# EAGLE schematic 7Seg 1Inch (EAGLE 7.2.0)
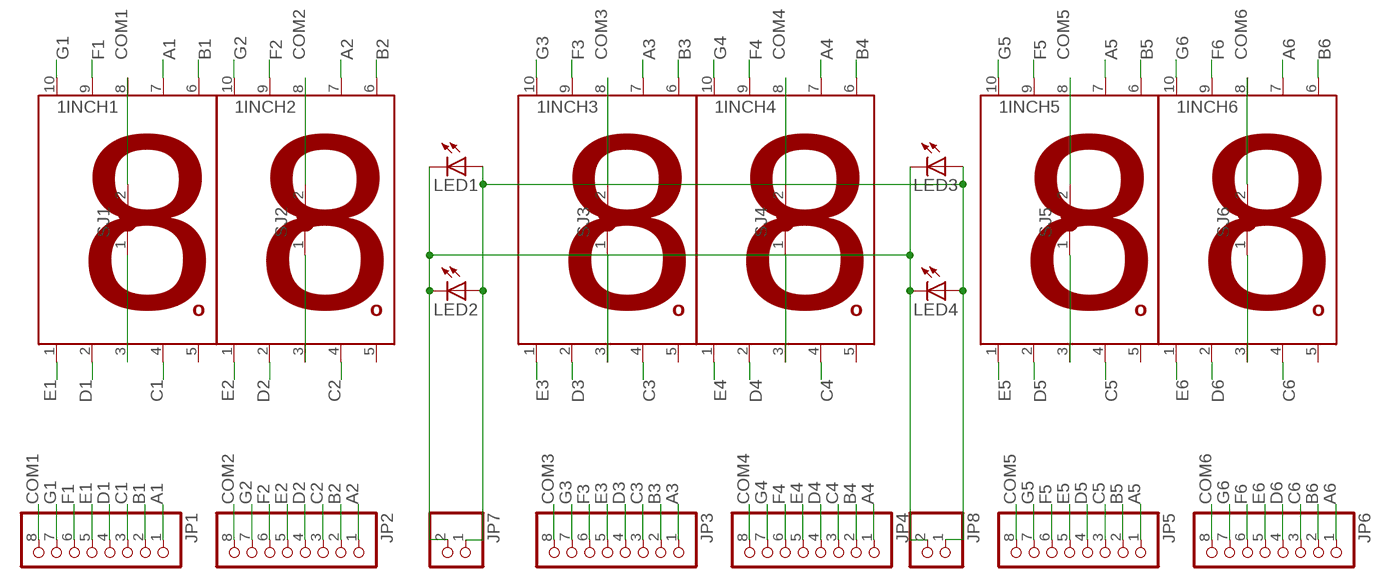
[diagram p0: schematic, sheet 1]

## Parts
1INCH1  7-SEG_1"_CUS  [7-SEG_1"_CUS]
1INCH2  7-SEG_1"_CUS  [7-SEG_1"_CUS]
1INCH3  7-SEG_1"_CUS  [7-SEG_1"_CUS]
1INCH4  7-SEG_1"_CUS  [7-SEG_1"_CUS]
1INCH5  7-SEG_1"_CUS  [7-SEG_1"_CUS]
1INCH6  7-SEG_1"_CUS  [7-SEG_1"_CUS]
JP1  PINHD-1X8  [1X08]
JP2  PINHD-1X8  [1X08]
JP3  PINHD-1X8  [1X08]
JP4  PINHD-1X8  [1X08]
JP5  PINHD-1X8  [1X08]
JP6  PINHD-1X8  [1X08]
JP7  PINHD-1X2  [1X02]
JP8  PINHD-1X2  [1X02]
LED1  LED5MM  [LED5MM]
LED2  LED5MM  [LED5MM]
LED3  LED5MM  [LED5MM]
LED4  LED5MM  [LED5MM]
SJ1  SJW  [SJW]
SJ2  SJW  [SJW]
SJ3  SJW  [SJW]
SJ4  SJW  [SJW]
SJ5  SJW  [SJW]
SJ6  SJW  [SJW]

## Nets
A1: 1INCH1.7 JP1.1
A2: 1INCH2.7 JP2.1
A3: 1INCH3.7 JP3.1
A4: 1INCH4.7 JP4.1
A5: 1INCH5.7 JP5.1
A6: 1INCH6.7 JP6.1
B1: 1INCH1.6 JP1.2
B2: 1INCH2.6 JP2.2
B3: 1INCH3.6 JP3.2
B4: 1INCH4.6 JP4.2
B5: 1INCH5.6 JP5.2
B6: 1INCH6.6 JP6.2
C1: 1INCH1.4 JP1.3
C2: 1INCH2.4 JP2.3
C3: 1INCH3.4 JP3.3
C4: 1INCH4.4 JP4.3
C5: 1INCH5.4 JP5.3
C6: 1INCH6.4 JP6.3
COM1: 1INCH1.3 1INCH1.8 JP1.8 SJ1.1 SJ1.2
COM2: 1INCH2.3 1INCH2.8 JP2.8 SJ2.1 SJ2.2
COM3: 1INCH3.3 1INCH3.8 JP3.8 SJ3.1 SJ3.2
COM4: 1INCH4.3 1INCH4.8 JP4.8 SJ4.1 SJ4.2
COM5: 1INCH5.3 1INCH5.8 JP5.8 SJ5.1 SJ5.2
COM6: 1INCH6.3 1INCH6.8 JP6.8 SJ6.1 SJ6.2
D1: 1INCH1.2 JP1.4
D2: 1INCH2.2 JP2.4
D3: 1INCH3.2 JP3.4
D4: 1INCH4.2 JP4.4
D5: 1INCH5.2 JP5.4
D6: 1INCH6.2 JP6.4
E1: 1INCH1.1 JP1.5
E2: 1INCH2.1 JP2.5
E3: 1INCH3.1 JP3.5
E4: 1INCH4.1 JP4.5
E5: 1INCH5.1 JP5.5
E6: 1INCH6.1 JP6.5
F1: 1INCH1.9 JP1.6
F2: 1INCH2.9 JP2.6
F3: 1INCH3.9 JP3.6
F4: 1INCH4.9 JP4.6
F5: 1INCH5.9 JP5.6
F6: 1INCH6.9 JP6.6
G1: 1INCH1.10 JP1.7
G2: 1INCH2.10 JP2.7
G3: 1INCH3.10 JP3.7
G4: 1INCH4.10 JP4.7
G5: 1INCH5.10 JP5.7
G6: 1INCH6.10 JP6.7
N$1: JP7.1 JP8.1 LED1.A LED2.A LED3.A LED4.A
N$3: JP7.2 JP8.2 LED1.K(C) LED2.K(C) LED3.K(C) LED4.K(C)
Unconnected: 1INCH1.5 1INCH2.5 1INCH3.5 1INCH4.5 1INCH5.5 1INCH6.5

## Library data of the parts
1INCH1-1INCH6 = 7SEG_OneIncCus:7-SEG_1"_CUS: 7 Segment One Inch
JP1-JP6 = pinhead:PINHD-1X8: PIN HEADER
JP7 JP8 = pinhead:PINHD-1X2: PIN HEADER
LED1-LED4 = led:LED: LED OSRAM: - CHIPLED LG R971, LG N971, LY N971, LG Q971, LY Q971, LO R971, LY R971 LH N974, LH R974 LS Q976, LO Q976, LY Q976 LO Q996 - Hyper CHIPLED LW Q18S LB Q993, LB Q99A, LB R99A - SideLED LS A670, LO A670, LY A670, LG A670, LP A670 LB A673, LV A673, LT A673, LW A673 LH A674 LY A675 LS A676, LA A676, LO A676, LY A676, LW A676 LS A679, LY A679, LG A679 - Hyper Micro SIDELED® LS Y876, LA Y876, LO Y876, LY Y876 LT Y87S - SmartLED LW L88C, LW L88S LB L89C, LB L89S, LG L890 LS L89K, LO L89K, LY L89K LS L896, LA L896, LO L896, LY L896 - TOPLED LS T670, LO T670, LY T670, LG T670, LP T670 LSG T670, LSP T670, LSY T670, LOP T670, LYG T670 LG T671, LOG T671, LSG T671 LB T673, LV T673, LT T673, LW T673 LH T674 LS T676, LA T676, LO T676, LY T676, LB T676, LH T676, LSB T676, LW T676 LB T67C, LV T67C, LT T67C, LS T67K, LO T67K, LY T67K, LW E67C LS E67B, LA E67B, LO E67B, LY E67B, LB E67C, LV E67C, LT E67C LW T67C LS T679, LY T679, LG T679 LS T770, LO T770, LY T770, LG T770, LP T770 LB T773, LV T773, LT T773, LW T773 LH T774 LS E675, LA E675, LY E675, LS T675 LS T776, LA T776, LO T776, LY T776, LB T776 LHGB T686 LT T68C, LB T68C - Hyper Mini TOPLED® LB M676 - Mini TOPLED Santana® LG M470 LS M47K, LO M47K, LY M47K Source: http://www.osram.convergy.de LUXEON: - LUMILED® LXK2-PW12-R00, LXK2-PW12-S00, LXK2-PW14-U00, LXK2-PW14-V00 LXK2-PM12-R00, LXK2-PM12-S00, LXK2-PM14-U00 LXK2-PE12-Q00, LXK2-PE12-R00, LXK2-PE12-S00, LXK2-PE14-T00, LXK2-PE14-U00 LXK2-PB12-K00, LXK2-PB12-L00, LXK2-PB12-M00, LXK2-PB14-N00, LXK2-PB14-P00, LXK2-PB14-Q00 LXK2-PR12-L00, LXK2-PR12-M00, LXK2-PR14-Q00, LXK2-PR14-R00 LXK2-PD12-Q00, LXK2-PD12-R00, LXK2-PD12-S00 LXK2-PH12-R00, LXK2-PH12-S00 LXK2-PL12-P00, LXK2-PL12-Q00, LXK2-PL12-R00 Source: www.luxeon.com KINGBRIGHT: KA-3528ASYC Source: www.kingbright.com
SJ1-SJ6 = jumper:SJ: SMD solder JUMPER